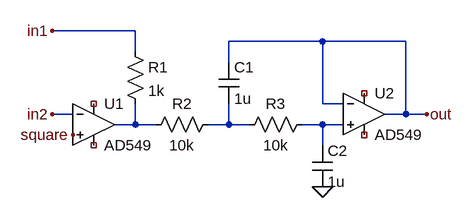
[diagram p0: schematic Multiple.asc]
Multiple.asc, the LTspice schematic file:
Version 4
SHEET 1 880 680
WIRE 96 -32 -32 -32
WIRE 384 -16 240 -16
WIRE 512 -16 384 -16
WIRE 96 0 96 -32
WIRE 240 16 240 -16
WIRE 384 80 384 -16
WIRE 416 80 384 80
WIRE 0 96 -32 96
WIRE 512 96 512 -16
WIRE 512 96 480 96
WIRE 544 96 512 96
WIRE 96 112 96 80
WIRE 96 112 64 112
WIRE 128 112 96 112
WIRE 240 112 240 80
WIRE 240 112 208 112
WIRE 272 112 240 112
WIRE 384 112 352 112
WIRE 416 112 384 112
WIRE 384 144 384 112
FLAG 544 96 out
FLAG -32 -32 in1
FLAG -32 96 in2
FLAG 0 128 square
FLAG 384 208 0
SYMBOL Opamps\\AD549 32 48 R0
SYMATTR InstName U1
SYMBOL Opamps\\AD549 448 32 R0
SYMATTR InstName U2
SYMBOL res 80 -16 R0
SYMATTR InstName R1
SYMATTR Value 1k
SYMBOL res 224 96 R90
WINDOW 0 0 56 VBottom 2
WINDOW 3 32 56 VTop 2
SYMATTR InstName R2
SYMATTR Value 10k
SYMBOL res 368 96 R90
WINDOW 0 0 56 VBottom 2
WINDOW 3 32 56 VTop 2
SYMATTR InstName R3
SYMATTR Value 10k
SYMBOL cap 224 16 R0
SYMATTR InstName C1
SYMATTR Value 1u
SYMBOL cap 368 144 R0
SYMATTR InstName C2
SYMATTR Value 1u

The netlist it stands for:
* Multiple.asc
XU1 square in2 NC_01 NC_02 N001 AD549  ; pins In+ In- V+ V- OUT
XU2 N003 out NC_03 NC_04 out AD549  ; pins In+ In- V+ V- OUT
R1 in1 N001 1k
R2 N002 N001 10k
R3 N003 N002 10k
C1 out N002 1u
C2 N003 0 1u
.backanno
.end